# EAGLE schematic EE445L_Lab_7_Starter (EAGLE 9.6.2)
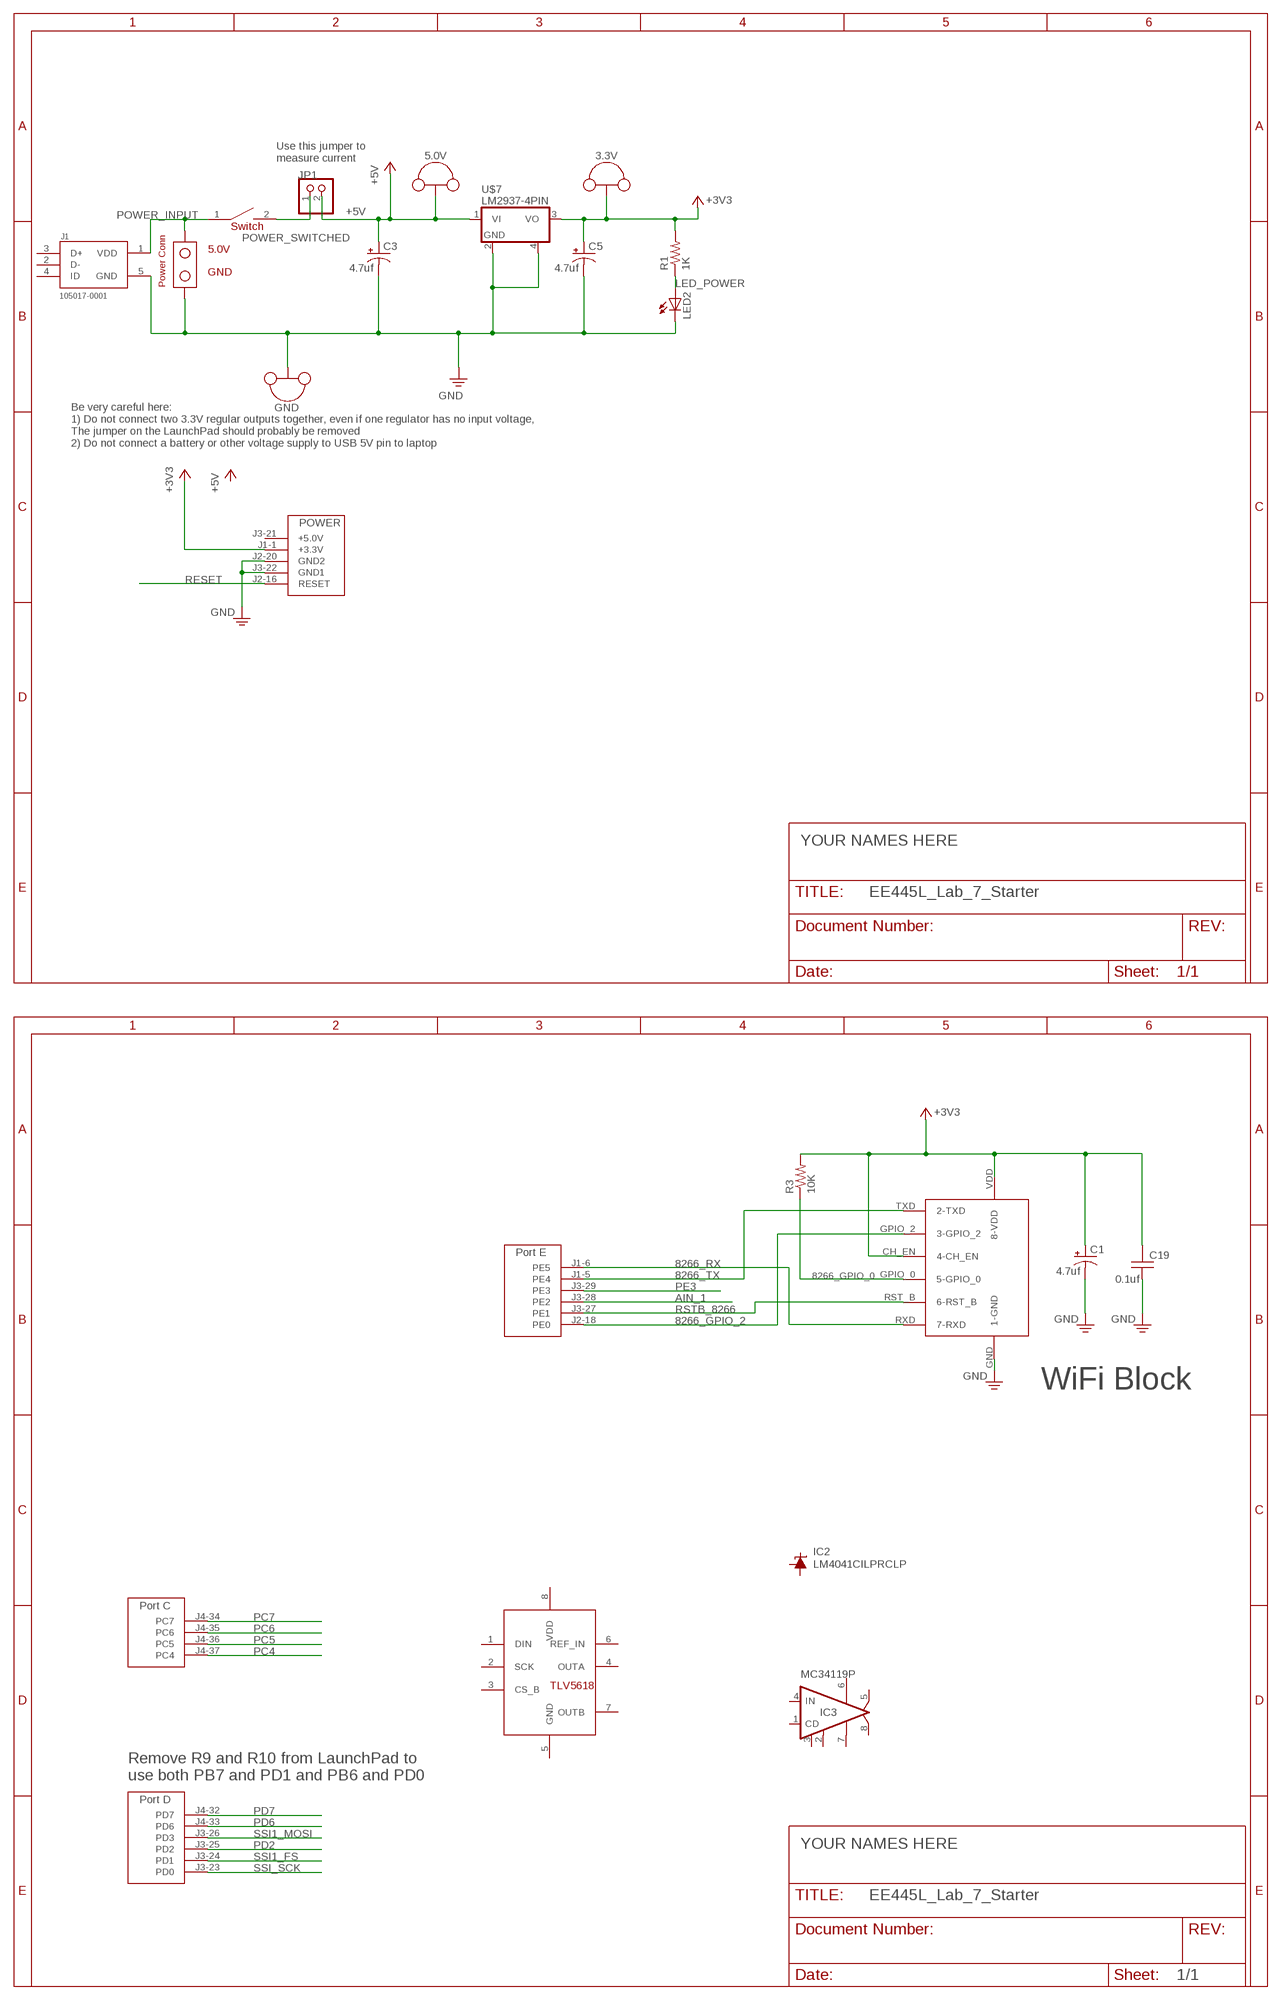
[diagram p0: schematic, sheet 1, part 1 of 2]
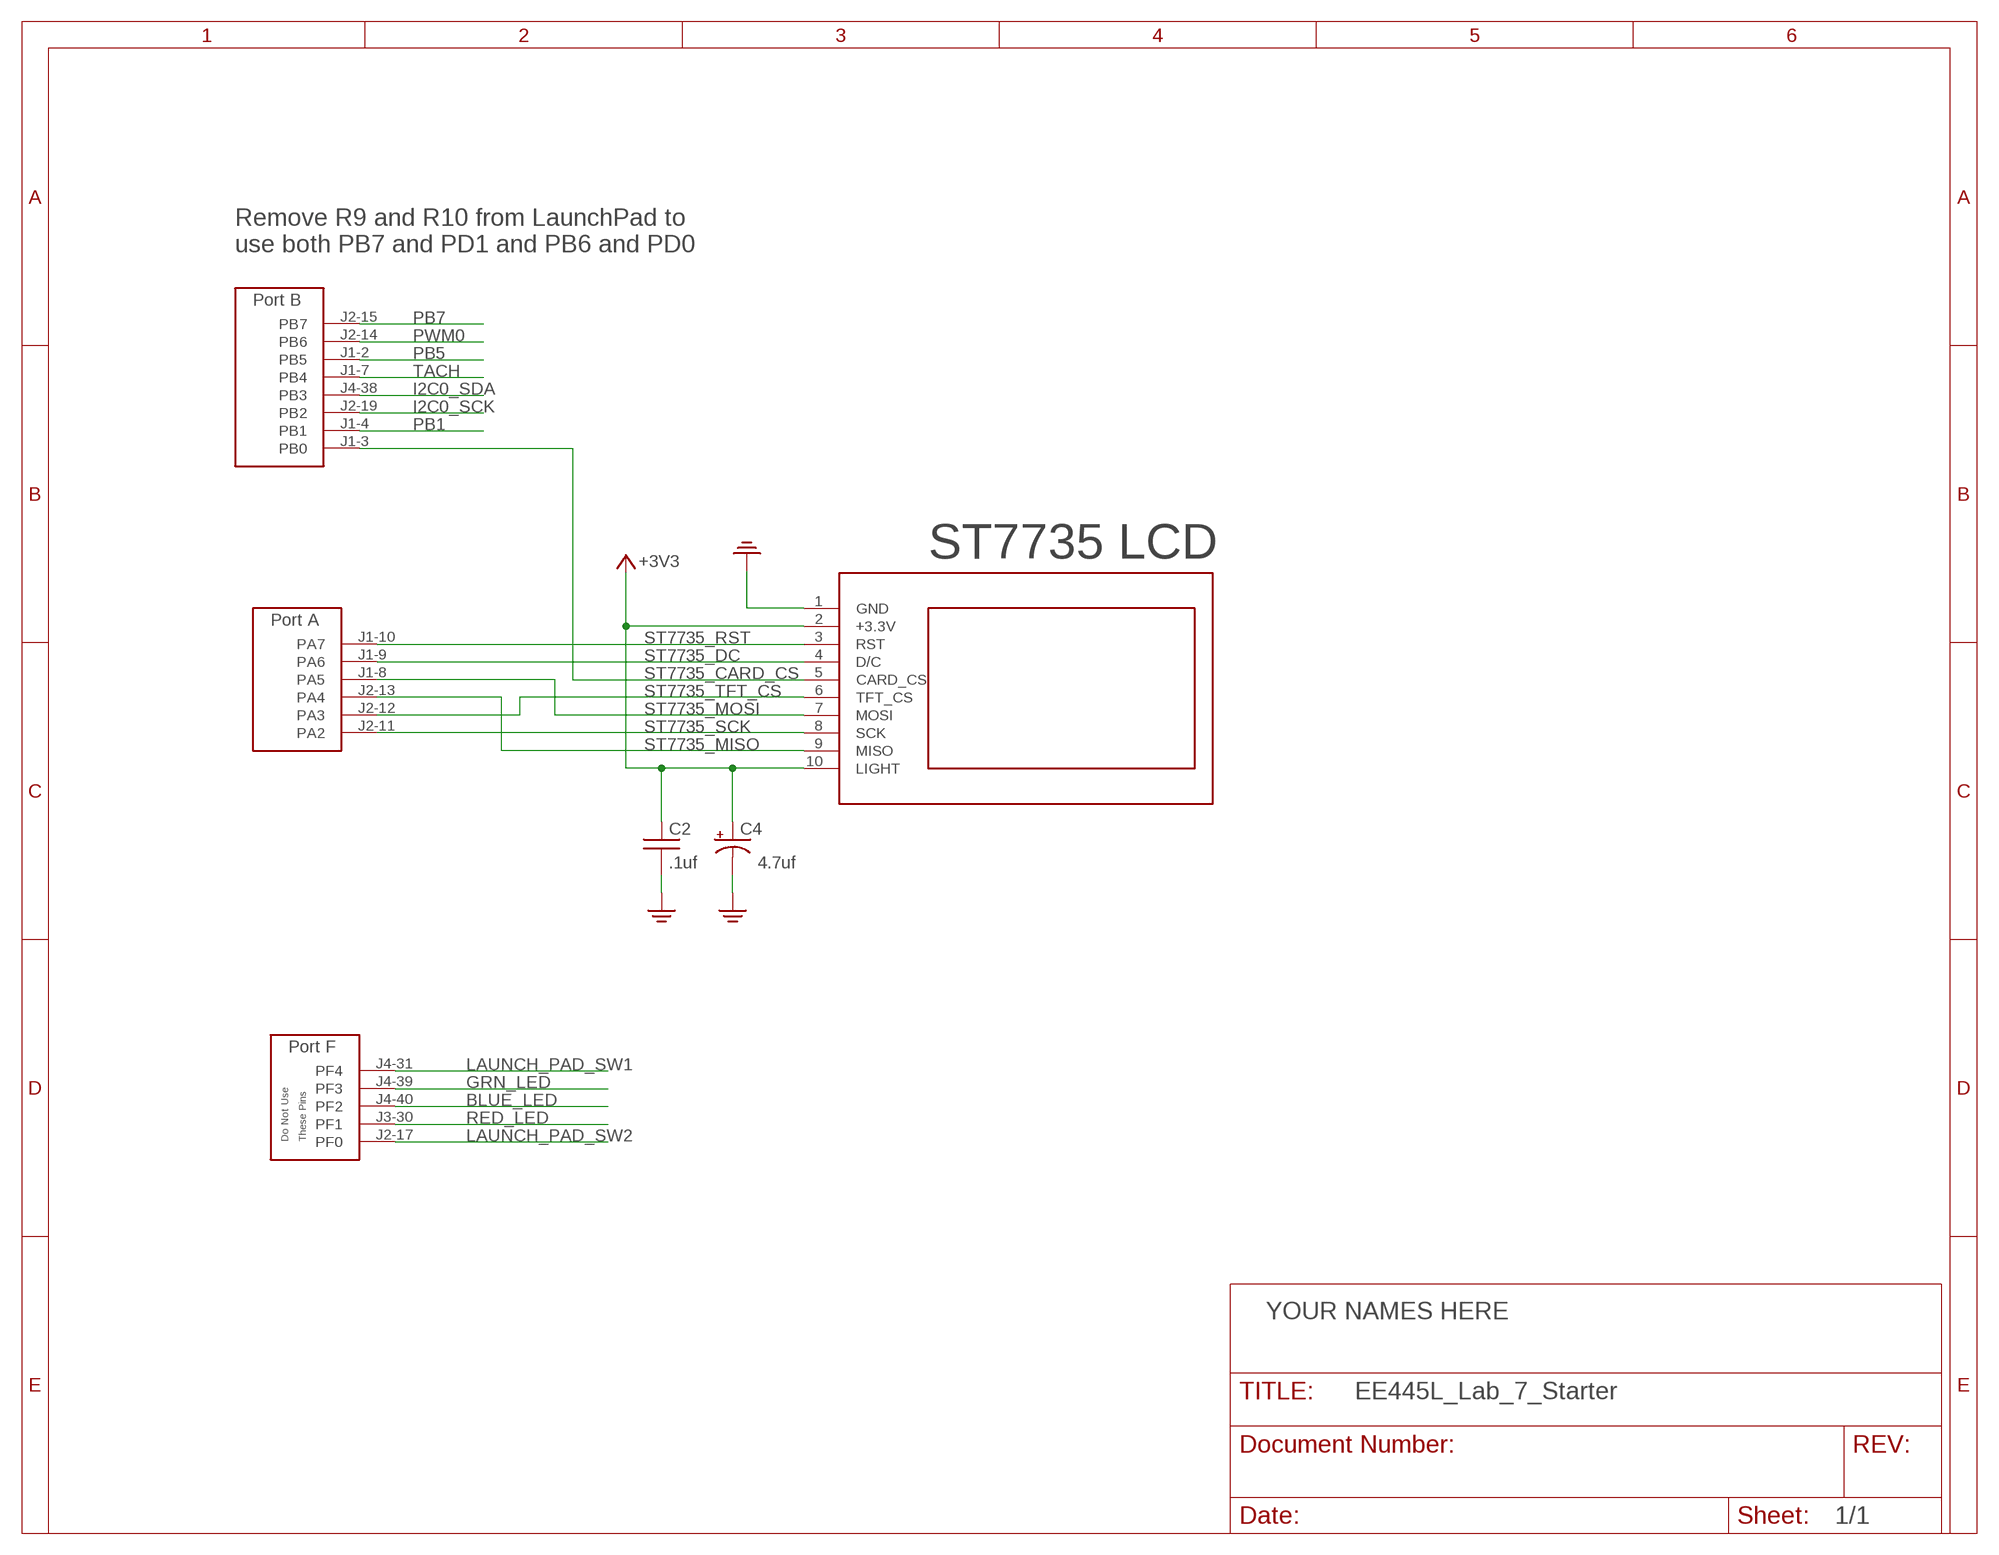
[diagram p1: schematic, sheet 1, part 2 of 2]

## Parts
3.3V  TP_LOOP  [TP_LOOP]
5.0V  TP_LOOP  [TP_LOOP]
C1  4.7uf  CAPACITOR_POLARIZEDE5-6  [CAP200MILPOLARIZED]
C2  .1uf  CAPACITOR050-024X044  [CAP200MIL]
C3  4.7uf  CAPACITOR_POLARIZEDE5-6  [CAP200MILPOLARIZED]
C4  4.7uf  CAPACITOR_POLARIZEDE5-6  [CAP200MILPOLARIZED]
C5  4.7uf  CAPACITOR_POLARIZEDE5-6  [CAP200MILPOLARIZED]
C19  0.1uf  CAPACITOR050-024X044  [CAP200MIL]
GND  TP_LOOP  [TP_LOOP]
IC2  LM4041CILPRCLP  [LP_O-PBCY-W3]
IC3  MC34119P  [DIL08]
J1  105017-0001  [MOLEX_105017-0001]
JP1  PINHD-1X2  [1X02]
LED2  LED3MM  [LED3MM]
R1  1K  RESISTOR0204/5  [RES200MIL]
R3  10K  RESISTOR0204/7  [RES300MIL]
U$1  ESP_8266  [ESP8266]
U$2  TM4C_BP  [TM4C_BOOSTER_PACK]
U$3  ST7735  [ST7735]
U$4  TLV5618  [DIL08]
U$5  POWER_CONN  [POWER_CONN]
U$6  SW_POWER_100MIL  [SW_POWER]
U$7  LM2937-4PIN  [TO220-4PIN]

## Nets
8266_GPIO_0: R3.1 U$1.GPIO_0(5-GPIO_0)
8266_GPIO_2: U$1.GPIO_2(3-GPIO_2) U$2.J2-18(PE0)
8266_RX: U$1.RXD(7-RXD) U$2.J1-6(PE5)
8266_TX: U$1.TXD(2-TXD) U$2.J1-5(PE4)
+3V3: 3.3V.P$1(TP) 3.3V.P$2(TP) C1.+ C2.1 C4.+ C5.+ C19.2 R1.2 R3.2 U$1.CH_EN(4-CH_EN) U$1.VDD(8-VDD) U$2.J1-1(+3.3V) U$3.2(+3.3V) U$3.10(LIGHT) U$7.3(VO)
+5V: 5.0V.P$1(TP) 5.0V.P$2(TP) C3.+ JP1.2 U$7.1(VI)
AIN_1: U$2.J3-28(PE2)
BLUE_LED: U$2.J4-40(PF2)
GND: C1.- C2.2 C3.- C4.- C5.- C19.1 GND.P$1(TP) GND.P$2(TP) J1.5(GND) LED2.K(C) U$1.GND(1-GND) U$2.J2-20(GND2) U$2.J3-22(GND1) U$3.1(GND) U$5.GND U$7.2(GND) U$7.4(PAD)
GRN_LED: U$2.J4-39(PF3)
I2C0_SCK: U$2.J2-19(PB2)
I2C0_SDA: U$2.J4-38(PB3)
LAUNCH_PAD_SW1: U$2.J4-31(PF4)
LAUNCH_PAD_SW2: U$2.J2-17(PF0)
LED_POWER: LED2.A R1.1
PB1: U$2.J1-4(PB1)
PB5: U$2.J1-2(PB5)
PB7: U$2.J2-15(PB7)
PC4: U$2.J4-37(PC4)
PC5: U$2.J4-36(PC5)
PC6: U$2.J4-35(PC6)
PC7: U$2.J4-34(PC7)
PD2: U$2.J3-25(PD2)
PD6: U$2.J4-33(PD6)
PD7: U$2.J4-32(PD7)
PE3: U$2.J3-29(PE3)
POWER_INPUT: J1.1(VDD) U$5.VDD U$6.1
POWER_SWITCHED: JP1.1 U$6.2
PWM0: U$2.J2-14(PB6)
RED_LED: U$2.J3-30(PF1)
RESET: U$2.J2-16(RESET)
RSTB_8266: U$1.RST_B(6-RST_B) U$2.J3-27(PE1)
SSI1_FS: U$2.J3-24(PD1)
SSI1_MOSI: U$2.J3-26(PD3)
SSI_SCK: U$2.J3-23(PD0)
ST7735_CARD_CS: U$2.J1-3(PB0) U$3.5(CARD_CS)
ST7735_DC: U$2.J1-9(PA6) U$3.4(D/C)
ST7735_MISO: U$2.J2-13(PA4) U$3.9(MISO)
ST7735_MOSI: U$2.J1-8(PA5) U$3.7(MOSI)
ST7735_RST: U$2.J1-10(PA7) U$3.3(RST)
ST7735_SCK: U$2.J2-11(PA2) U$3.8(SCK)
ST7735_TFT_CS: U$2.J2-12(PA3) U$3.6(TFT_CS)
TACH: U$2.J1-7(PB4)
Unconnected: IC2.1(FB) IC2.2(C) IC2.3(A) IC3.1(CD) IC3.2(FC2) IC3.3(FC1) IC3.4(IN) IC3.5(VO1) IC3.8(VO2) J1.2(D-) J1.3(D+) J1.4(ID) U$2.J3-21(+5.0V) U$4.1(DIN) U$4.2(SCK) U$4.3(CS_B) U$4.4(OUTA) U$4.5(GND) U$4.6(REF_IN) U$4.7(OUTB) U$4.8(VDD)

## Notes on the sheet
- Use this jumper to
  measure current
- Be very careful here:
  1) Do not connect two 3.3V regular outputs together, even if one regulator has no input voltage,
  The jumper on the LaunchPad should probably be removed
  2) Do not connect a battery or other voltage supply to USB 5V pin to laptop
- YOUR NAMES HERE
- Remove R9 and R10 from LaunchPad to
  use both PB7 and PD1 and PB6 and PD0
- ST7735 LCD
- WiFi Block
- Remove R9 and R10 from LaunchPad to
  use both PB7 and PD1 and PB6 and PD0
- YOUR NAMES HERE
- YOUR NAMES HERE

## Power pins joined to a net without a drawn wire
GND: IC3.7(GND)
VCC: IC3.6(VCC)

## Library data of the parts
3.3V 5.0V GND = EE445L:TP_LOOP
C1 C3-C5 = EE445L:CAPACITOR_POLARIZED: POLARIZED CAPACITOR, American symbol
C2 C19 = EE445L:CAPACITOR: CAPACITOR, American symbol
IC2 = EE445L:LM4041CILPR: PRECISION MICROPOWER SHUNT VOLTAGE REFERENCE Adjustable Output Source: http://focus.ti.com/lit/ds/slcs146e/slcs146e.pdf LM4041CILPR Let R1 be the resistor from Vref to +3.3V Let R2 be the resistor from Vref to FB Let R3 be the resistor from FB to ground Vref = 1.23*(1+R3/R2) Iref=(3.3V-Vref)/R1 - 100uA; MPN: LM4041CILP; OC_FARNELL: 1673945; OC_NEWARK: 50M8856
IC3 = EE445L:MC34119: Low Power Audio Amplifier Motorola
J1 = 105017-0001:105017-0001: Check availability <https://pricing.snapeda.com/parts/105017-0001/Molex/view-part?ref=eda>; AVAILABILITY: In Stock; DESCRIPTION: USB - micro B USB 2.0 Receptacle Connector 5 Position Surface Mount, Right Angle; Through Hole; MF: Molex; MP: 105017-0001; PACKAGE: None; PRICE: None; PURCHASE-URL: https://pricing.snapeda.com/search/part/105017-0001/?ref=eda
JP1 = EE445L:PINHD-1X2: PIN HEADER
LED2 = EE445L:LED: Avago Technologies LED Green 2mA 5mm diffused, HLMP-4740, Digikey 516-1327-ND Red 1.6V 1mA 5mm diffused, HLMP-D150, Digikey 516-1323-ND Yellow 2mA 5mm diffused, HLMP-4719, Digikey 516-1326-ND Orange 10mA 5mm diffused HLMP-D401, Digikey 516-1330-ND Blue 10mA 5mm diffused
R1 R3 = EE445L:RESISTOR: RESISTOR, American symbol
U$1 = EE445L:ESP_8266
U$2 = EE445L:TM4C_BP
U$3 = EE445L:ST7735
U$4 = EE445L:TLV5618: The TLV5618A is a dual 12-bit voltage output DAC with a flexible 3-wire serial interface. The serial interface is compatible with TMS320, SPI, QSPI, and Microwire serial ports. It is programmed with a 16-bit serial string containing 4 control and 12 data bits
U$5 = EE445L:POWER_CONN
U$6 = EE445L:SW_POWER_100MIL
U$7 = EE445L:LM2937-4PIN